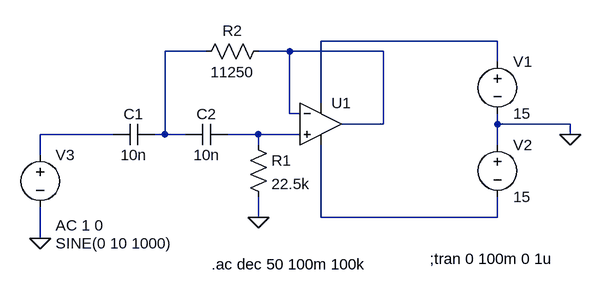
[diagram p0: schematic PA_aula.asc]
PA_aula.asc, the LTspice schematic file:
Version 4
SHEET 1 880 680
WIRE 496 48 224 48
WIRE 48 64 -16 64
WIRE 176 64 128 64
WIRE 320 64 176 64
WIRE 496 80 496 48
WIRE 224 144 224 48
WIRE 176 160 176 64
WIRE 192 160 176 160
WIRE 320 176 320 64
WIRE 320 176 256 176
WIRE 496 176 496 160
WIRE 608 176 496 176
WIRE -96 192 -208 192
WIRE -16 192 -16 64
WIRE -16 192 -32 192
WIRE 16 192 -16 192
WIRE 128 192 80 192
WIRE 192 192 128 192
WIRE 608 192 608 176
WIRE 128 208 128 192
WIRE 496 208 496 176
WIRE -208 224 -208 192
WIRE 128 320 128 288
WIRE 224 320 224 208
WIRE 496 320 496 288
WIRE 496 320 224 320
WIRE -208 352 -208 304
FLAG 128 320 0
FLAG 608 192 0
FLAG -208 352 0
SYMBOL OpAmps\\UniversalOpAmp 224 176 R0
SYMATTR InstName U1
SYMBOL cap -32 176 R90
WINDOW 0 0 32 VBottom 2
WINDOW 3 32 32 VTop 2
SYMATTR InstName C1
SYMATTR Value 10n
SYMBOL cap 80 176 R90
WINDOW 0 0 32 VBottom 2
WINDOW 3 32 32 VTop 2
SYMATTR InstName C2
SYMATTR Value 10n
SYMBOL res 112 192 R0
SYMATTR InstName R1
SYMATTR Value 22.5k
SYMBOL res 144 48 R90
WINDOW 0 0 56 VBottom 2
WINDOW 3 32 56 VTop 2
SYMATTR InstName R2
SYMATTR Value 11250
SYMBOL voltage 496 64 R0
WINDOW 123 0 0 Left 0
WINDOW 39 0 0 Left 0
SYMATTR InstName V1
SYMATTR Value 15
SYMBOL voltage 496 192 R0
WINDOW 123 0 0 Left 0
WINDOW 39 0 0 Left 0
SYMATTR InstName V2
SYMATTR Value 15
SYMBOL voltage -208 208 R0
WINDOW 3 24 152 Left 2
WINDOW 123 24 124 Left 2
WINDOW 39 0 0 Left 0
SYMATTR Value SINE(0 10 1000)
SYMATTR Value2 AC 1 0
SYMATTR InstName V3
TEXT 392 384 Left 2 !;tran 0 100m 0 1u
TEXT 56 392 Left 2 !.ac dec 50 100m 100k

The netlist it stands for:
* PA_aula.asc
XU1 N005 N003 N001 N006 N003 level1 Avol=1Meg GBW=10Meg Vos=0 En=0 Enk=0 In=0 Ink=0 Rin=500Meg  ; pins In+ In- V+ V- OUT
C1 N002 N004 10n
C2 N005 N002 10n
R1 N005 0 22.5k
R2 N003 N002 11250
V1 N001 0 15
V2 0 N006 15
V3 N004 0 SINE(0 10 1000) AC 1 0
;tran 0 100m 0 1u
.ac dec 50 100m 100k
.lib UniversalOpAmp1.lib
.backanno
.end